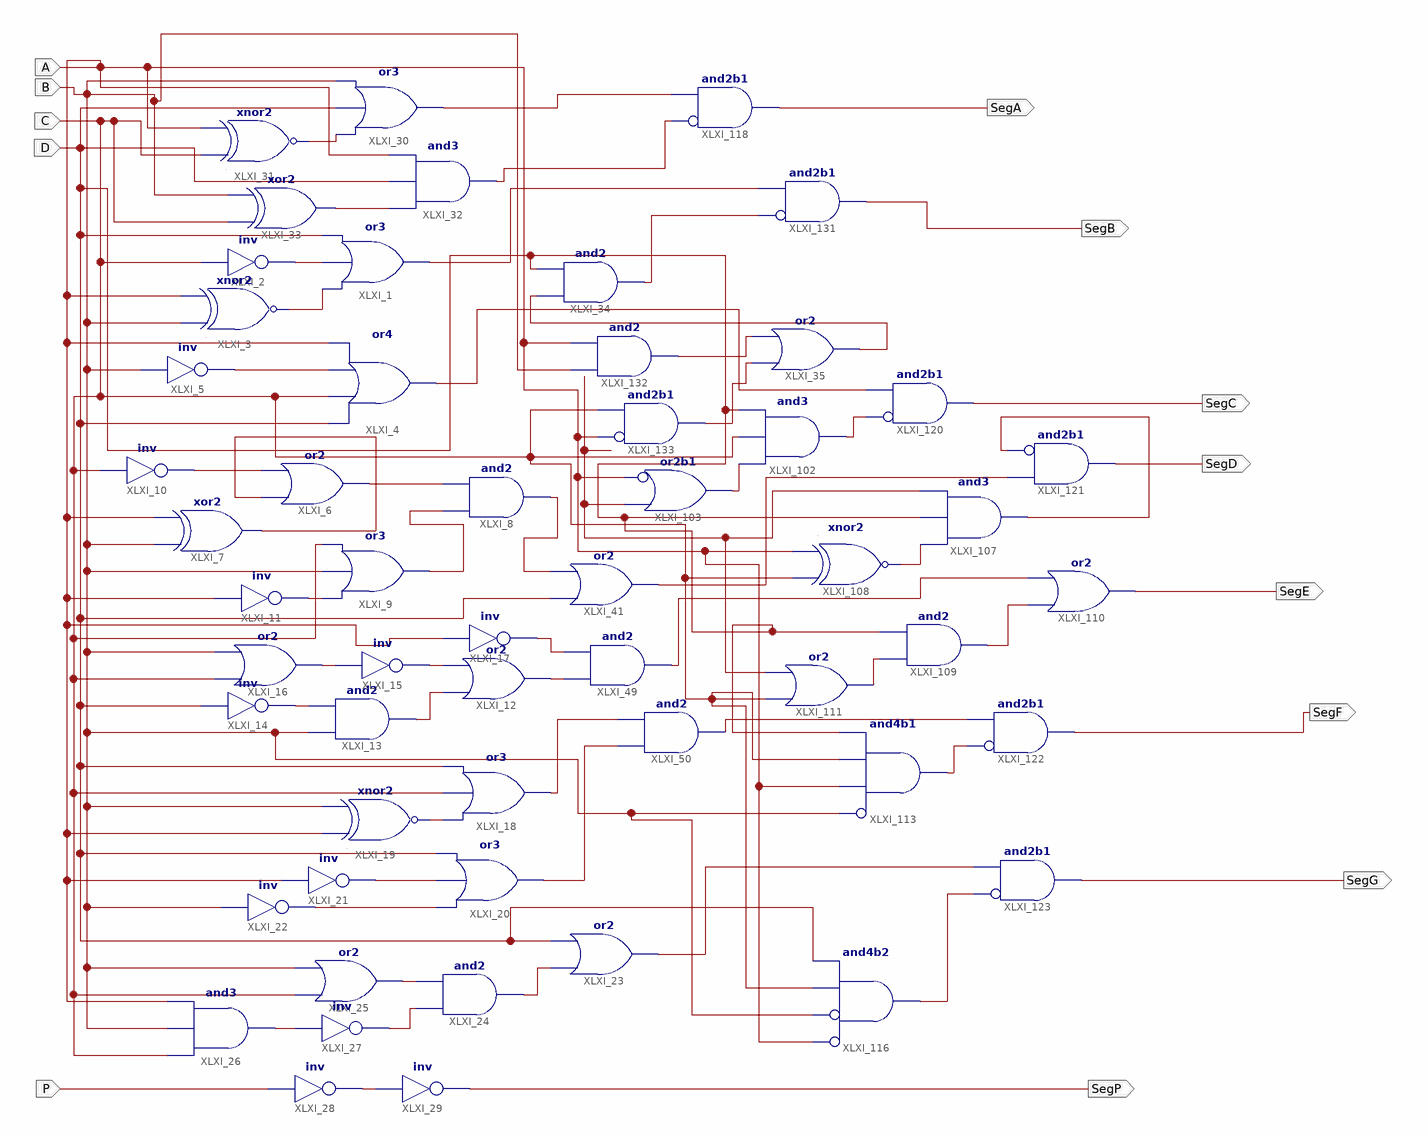
[diagram p0: schematic sheet 1]
// Xilinx ISE schematic Svn.sch (spartan6) as structural Verilog: 55 symbols, 13 ports
module Svn (
  input  C,
  input  D,
  input  P,
  input  B,
  input  A,
  output SegP,
  output SegA,
  output SegB,
  output SegC,
  output SegD,
  output SegE,
  output SegF,
  output SegG
);

  wire m, n, o, s, XLXN_1, XLXN_3, XLXN_4, XLXN_5, XLXN_6, XLXN_7, XLXN_8, XLXN_9, XLXN_10, XLXN_58, XLXN_74,
       XLXN_77, XLXN_79, XLXN_82, XLXN_83, XLXN_84, XLXN_87, XLXN_88, XLXN_91, XLXN_93, XLXN_96, XLXN_99,
       XLXN_102, XLXN_105, XLXN_111, XLXN_112, XLXN_113, XLXN_114, XLXN_116, XLXN_120, XLXN_122, XLXN_136,
       XLXN_139, XLXN_146, XLXN_211, XLXN_214, XLXN_215, XLXN_219, XLXN_222, XLXN_223, XLXN_236, XLXN_240,
       XLXN_241;

  or XLXI_1 (m, XLXN_4, XLXN_3, D);
  not XLXI_2 (XLXN_3, C);
  xnor XLXI_3 (XLXN_4, B, A);
  or XLXI_4 (o, D, C, XLXN_5, A);
  not XLXI_5 (XLXN_5, B);
  or XLXI_6 (XLXN_6, XLXN_8, XLXN_7);
  xor XLXI_7 (XLXN_8, B, A);
  and XLXI_8 (XLXN_79, XLXN_9, XLXN_6);
  or XLXI_9 (XLXN_9, XLXN_10, B, C);
  not XLXI_10 (XLXN_7, C);
  not XLXI_11 (XLXN_10, A);
  or XLXI_12 (XLXN_82, XLXN_83, XLXN_87);
  and XLXI_13 (XLXN_83, B, XLXN_84);
  not XLXI_14 (XLXN_84, D);
  not XLXI_15 (XLXN_87, XLXN_88);
  or XLXI_16 (XLXN_88, C, B);
  not XLXI_17 (XLXN_91, A);
  or XLXI_18 (XLXN_93, XLXN_96, C, D);
  xnor XLXI_19 (XLXN_96, A, B);
  or XLXI_20 (XLXN_99, XLXN_105, XLXN_102, D);
  not XLXI_21 (XLXN_102, A);
  not XLXI_22 (XLXN_105, B);
  or XLXI_23 (XLXN_77, XLXN_111, D);
  and XLXI_24 (XLXN_111, XLXN_114, XLXN_112);
  or XLXI_25 (XLXN_112, C, B);
  and XLXI_26 (XLXN_113, C, B, A);
  not XLXI_27 (XLXN_114, XLXN_113);
  not XLXI_28 (XLXN_116, P);
  not XLXI_29 (SegP, XLXN_116);
  or XLXI_30 (XLXN_122, XLXN_1, D, B);
  xnor XLXI_31 (XLXN_1, C, A);
  and XLXI_32 (n, XLXN_120, D, A);
  xor XLXI_33 (XLXN_120, C, B);
  and XLXI_34 (XLXN_241, XLXN_136, D);
  or XLXI_35 (XLXN_136, XLXN_146, XLXN_139);
  and XLXI_102 (XLXN_211, XLXN_214, C, D);
  or XLXI_41 (XLXN_58, D, XLXN_79);
  or XLXI_103 (XLXN_214, ~A, B);  // or2b1
  and XLXI_107 (XLXN_215, B, D, XLXN_219);
  xnor XLXI_108 (XLXN_219, A, C);
  or XLXI_110 (SegE, s, XLXN_222);
  and XLXI_109 (XLXN_222, D, XLXN_223);
  or XLXI_111 (XLXN_223, B, C);
  and XLXI_49 (s, XLXN_82, XLXN_91);
  and XLXI_50 (XLXN_74, XLXN_99, XLXN_93);
  and XLXI_113 (XLXN_236, ~B, A, C, D);  // and4b1
  and XLXI_116 (XLXN_240, ~A, ~B, C, D);  // and4b2
  and XLXI_118 (SegA, ~n, XLXN_122);  // and2b1
  and XLXI_120 (SegC, ~XLXN_211, o);  // and2b1
  and XLXI_121 (SegD, ~XLXN_215, XLXN_58);  // and2b1
  and XLXI_122 (SegF, ~XLXN_236, XLXN_74);  // and2b1
  and XLXI_123 (SegG, ~XLXN_240, XLXN_77);  // and2b1
  and XLXI_131 (SegB, ~XLXN_241, m);  // and2b1
  and XLXI_132 (XLXN_139, B, A);
  and XLXI_133 (XLXN_146, ~A, C);  // and2b1
endmodule
